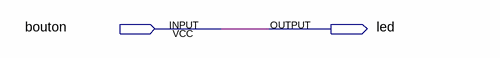
[diagram p0: schematic sheet]
// Quartus schematic testUnitBouton.bdf as structural Verilog: 0 symbols, 2 pins
module testUnitBouton (
  input  bouton,
  output led
);


  assign led = bouton;
endmodule
